# EAGLE design OPT3001 (EAGLE 6.5.0)
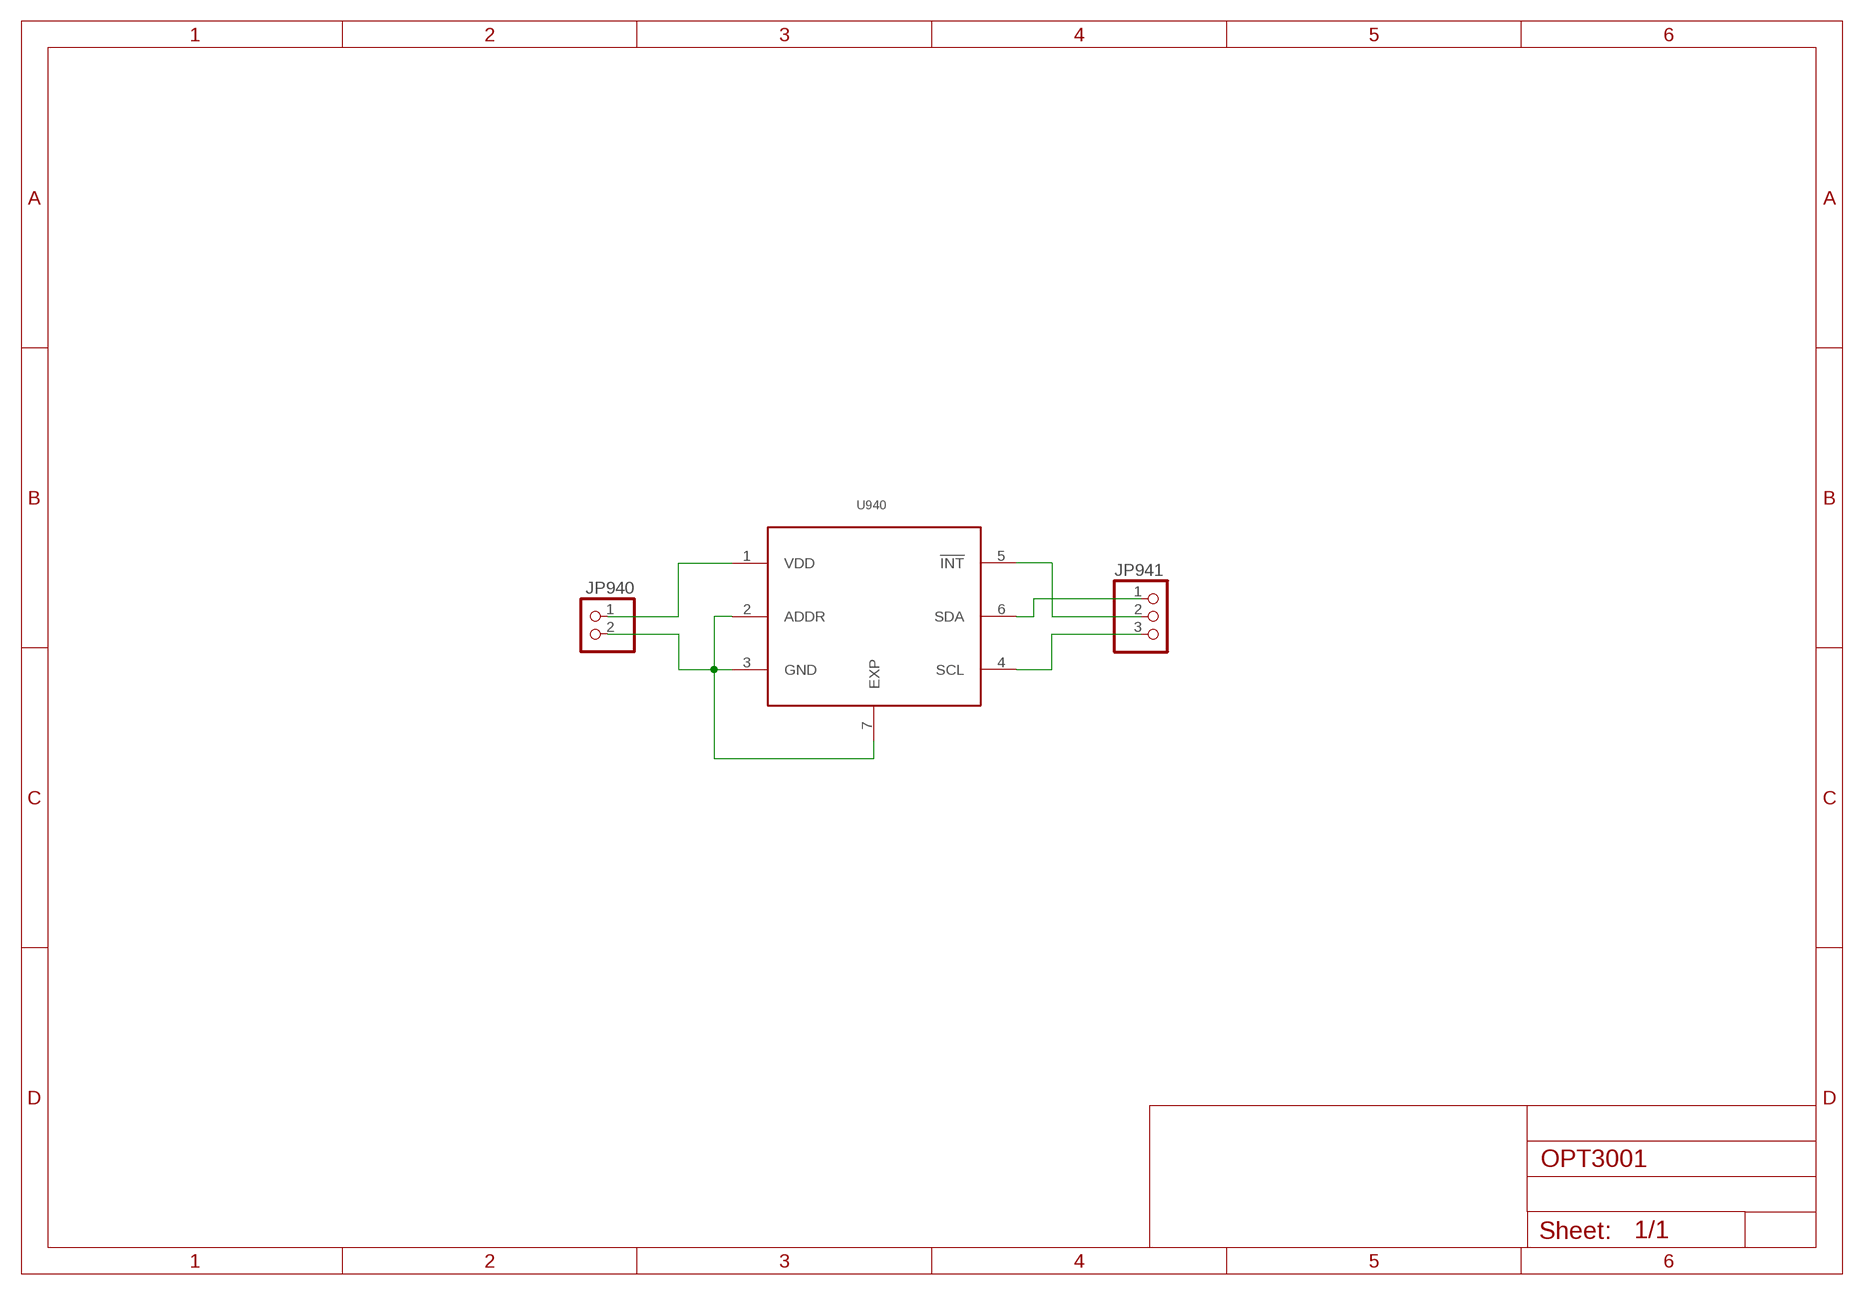
[diagram p0: schematic, sheet 1]

## Parts
JP940  PINHD-1X2  [1X02]
JP941  PINHD-1X3  [1X03]
U940  OPT3001  [SON65P200X200X65-7T66X136N]

## Nets
N$1: JP940.1 U940.1(VDD)
N$2: JP940.2 U940.2(ADDR) U940.3(GND) U940.7(EXP)
N$3: JP941.2 U940.5(!INT)
N$4: JP941.1 U940.6(SDA)
N$5: JP941.3 U940.4(SCL)

## Library data of the parts
JP940 = pinhead:PINHD-1X2: PIN HEADER
JP941 = pinhead:PINHD-1X3: PIN HEADER
U940 = Radio Projekt:OPT3001

## Board
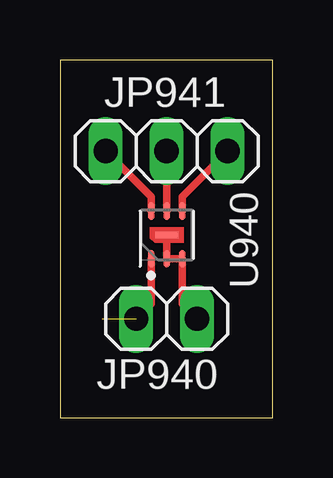
[diagram p1: board, top side]

Size 8.87 x 14.91 mm. Coordinates in mm from the lower left corner, seen from the top.
Outline: 0,0 8.87,0 8.87,14.91 0,14.91 0,0
Copper layers (1*16): Top 0.035mm / dielectric 1.5mm / Bottom 0.035mm
Design rules "PCB-POOL Standard": minimum track width 0.15mm, minimum drill 0.3mm, track to track 0.15mm, track to pad 0.15mm, pad to pad 0.15mm, via to via 0.15mm, smd to smd 0.15mm, copper to edge 0.3mm, drill to drill 0.2mm, minimum pad ring 0.2mm, minimum via ring 0.15mm, stop-mask expansion 0.075mm, vias tented up to drill 0mil, thermal gap 0.2mm

### Footprints (pad centres in the part's own frame; a part is rotated, then mirrored left to right if it is on the bottom)
1X02 = drill 1.016 long: 1 -1.27,0; 2 1.27,0
1X03 = drill 1.016 long: 1 -2.54,0; 2 0,0; 3 2.54,0
SON65P200X200X65-7T66X136N = smd 0.27 x 0.74: 1 -0.65,-0.995; 2 0,-0.995; 3 0.65,-0.995; 4 0.65,0.995; 5 0,0.995; 6 -0.65,0.995 | smd 0.96 x 0.26: 7 0,0

### Placement (x,y rotation side)
JP940  4.45,4.13 0 top
JP941  4.45,11.11 0 top
U940  4.45,7.62 0 top

### Tracks (layer width: path | path; a pad name or v marks a point on that pad's centre or on a via)
N$1  (1 unrouted)
  Top 0.305: JP940.1 3.79,4.75 U940.1
N$2
  Top 0.305: JP940.2 5.09,4.75 U940.3 U940.2 U940.7
N$3
  Top 0.305: JP941.2 U940.5
N$4
  Top 0.305: JP941.1 3.79,9.22 U940.6
N$5
  Top 0.305: JP941.3 5.09,9.22 U940.4